# Altium schematic sheet led_touch_sensor_schematic.SchDoc
size A4
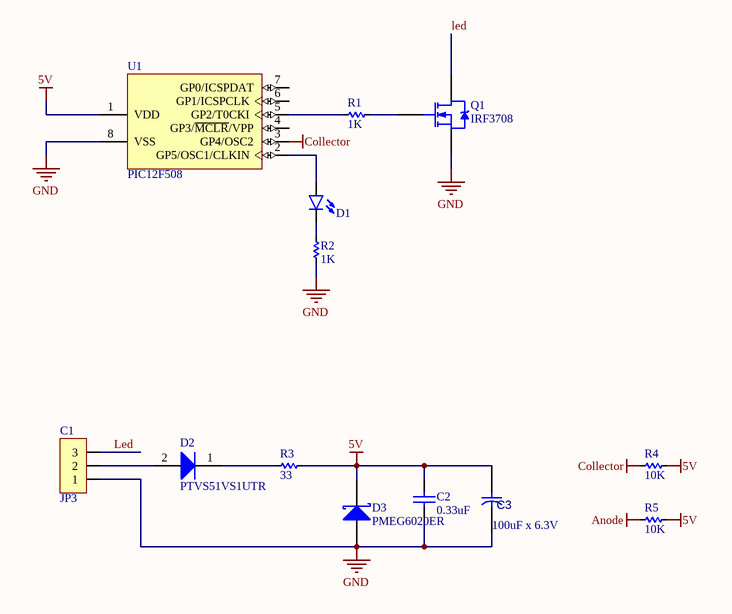
[diagram p0: led_touch_sensor_schematic.SchDoc]

## Parts
C1  JP3  [JP3-D1T]
C2  value 0.33uF  [C0603[1608X92]]  (hidden comment: 0.33uF 25V 0603)
C3  Valor: 100uF x 6.3V  [CASE B]  (hidden comment: CAPACITOR TANTALO)
D1  LED_0603_ORANGE_5mA  [LED0603]  (value not drawn)
D2  PTVS51VS1UTR  [SOD-123W]
D3  PMEG6020ER  [SOD-123]
Q1  IRF3708  [TO-252AA_M]
R1  1K  [RES-SMD-0603]
R2  1K  [RES-SMD-0603]
R3  33  [RES-SMD-0603]
R4  10K  [RES-SMD-0603]
R5  10K  [RES-SMD-0603]
U1  PIC12F508  [SO8]

## Nets
5V: C2.2 C3.1 D3.1(K) R3.1 R4.1 R5.1 U1.1(VDD)
Anode: R5.2
Collector: R4.2 U1.3(GP4/OSC2)
GND: C1.1 C2.1 C3.2 D3.2(A) Q1.3(S) R2.2 U1.8(VSS)
Led: C1.3 Q1.4(D)
NetC1_2: C1.2 D2.2(A)
NetD1_A: D1.A U1.2(GP5/OSC1/CLKIN)
NetD1_C: D1.C R2.1
NetD2_1: D2.1(K) R3.2
NetQ1_1: Q1.1(G) R1.1
NetR1_2: R1.2 U1.5(GP2/T0CKI)

Not connected (* = marked no-connect by the designer): U1 4(GP3/~{MCLR}/VPP) 6(GP1/ICSPCLK) 7(GP0/ICSPDAT)

## Library data of the parts
C1 = JP3: WR-PHD 2.54 mm Angled Socket Header; Manufacturer: W¨¹rth Elektronik eiSos GmbH; partNo: 613003143121; ComponentLink1 Description: Manufacturer; ComponentLink2 Description: Datasheet; NoPins: 03; Created Date: 29 March 2013; ComponentLink1URL: http://www.we-online.com; ComponentLink2URL: http://katalog.we-online.de/em/datasheet/6130xx143121.pdf; Created by: Karrer Zheng
C2 = CAP_0.33uF_25V_0603_10%: 0.33uF 25V 10% 0603 (1608 Metric); PartNumber: GCJ188R91E334KA01D; Manufacturer: Murata; Mounting Technology: Surface Mount; PackageReference: 0603; PackageDescription: 0603 (1608 Metric); Voltage: 25V; Tolerance: 10%
C3 = CAPACITOR TANTALO: CAPACITOR TANTALO Case B; Descrição: Capacitor de Tantalo; Encapsulamento: SMD Case B; Marca: *; Modelo: *; Observação: *
D1 = LED_0603_ORANGE_5mA: PartNumber: LTST-C193KFKT-5A; Manufacturer: Lite-On Inc.; PackageReference: 0603; PackageDescription: 0603 (1608 Metric); Mounting Technology: Surface Mount
D2 = PTVS51VS1UTR,115: Manufacturer: NXP; PackageReference: SOD-123W; PartNumber: PTVS51VS1UTR,115; Mounting Technology: Surface Mount; PackageDescription: SOD123W, 2-Leads
D3 = PMEG6020ER: PartNumber: PMEG6020ER,115; Manufacturer: NXP Semiconductors; PackageDescription: SOD, 2-Leads, Body 2.69x1.6mm; PackageReference: SOD-123W; Mounting Technology: Surface Mount
Q1 = IRFR18N15D: HEXFET Power MOSFET; Note: Pin 2 is trimmed and not drawn; Published: 17-Sep-2003; LatestRevisionDate: 20-Nov-2009; LatestRevisionNote: IPC-7351 Footprint Added.; DatasheetVersion: 23-Feb-2000; PackageVersion: Feb-2003; PackageReference: TO-252AA; Publisher: Altium Limited; PackageDescription: 3-Pin HEXFET Package 2.28 mm Pitch, 9.9 mm Lead Span; Code_JEDEC: TO-252-AA; ComponentLink1Description: Manufacturer Link; ComponentLink1URL: http://www.irf.com/; ComponentLink2Description: Datasheet; ComponentLink2URL: http://www.irf.com/product-info/datasheets/data/irfr18n15d.pdf
R1-R5 = Res-SMD: Resistor; Manufacturer: Generic Components; Class: Passive; Published: 08/06/2000; Publisher: Altium Hobart Technology Centre
U1 = PIC12F508: 8-bit Flash Microcontroller, 512 (x12-Bit words) Program Memory, 25 Bytes Data Memory, 8-Pin PDIP, Extended Temperature; Published: 29-Jan-2009; LatestRevisionDate: 02-Dec-2009; LatestRevisionNote: Updated to datasheet revision revE, Aug-2009; DatasheetVersion: revE, Aug-2009; PackageVersion: revBB, Aug-2009; PackageReference: PDIP300-P8; Publisher: Altium Limited; PackageDescription: 8-Lead Plastic Dual In-Line (P) - 300 mil Body [PDIP]; Supplier 1: Digi-Key; Supplier Part Number 1: PIC12F508-E/P-ND; Supplier 2: Farnell; Supplier Part Number 2: 1816016; Code_JEDEC: MS-001; ComponentLink1Description: Datasheet; ComponentLink1URL: http://ww1.microchip.com/downloads/en/DeviceDoc/41236E.pdf; ComponentLink2Description: Packaging Specification; ComponentLink2URL: http://www.microchip.com/stellent/groups/techpub_sg/documents/packagingspec/en012702.pdf; ComponentLink3Description: Microchip.com Home; ComponentLink3URL: http://www.microchip.com/